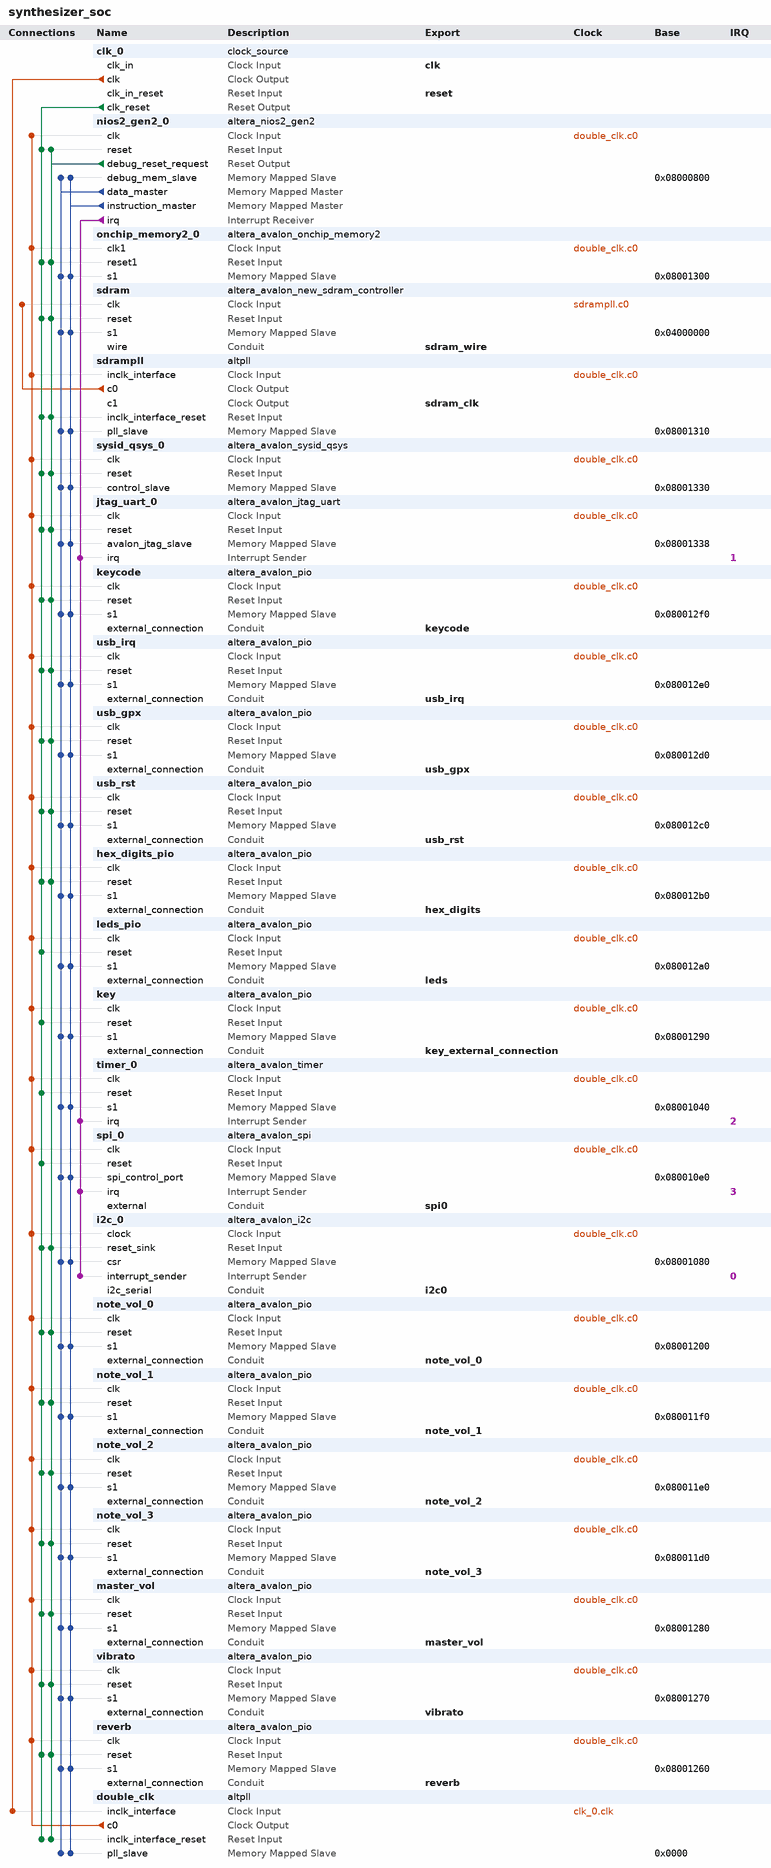
[diagram p0: system contents]
# Platform Designer (Qsys) system synthesizer_soc, MAX 10 10M50DAF484C7G
# Parameters at their usual value, and those the tool derives, are not listed.
package require -exact qsys 18.1
create_system synthesizer_soc
set_project_property DEVICE_FAMILY {MAX 10}
set_project_property DEVICE 10M50DAF484C7G

add_instance clk_0 clock_source 18.1
set_instance_parameter_value clk_0 clockFrequency 50000000

add_instance nios2_gen2_0 altera_nios2_gen2 18.1
set_instance_parameter_value nios2_gen2_0 dcache_size 2048
set_instance_parameter_value nios2_gen2_0 exceptionSlave sdram.s1
set_instance_parameter_value nios2_gen2_0 icache_size 4096
set_instance_parameter_value nios2_gen2_0 impl Tiny
set_instance_parameter_value nios2_gen2_0 resetSlave sdram.s1

add_instance onchip_memory2_0 altera_avalon_onchip_memory2 18.1
set_instance_parameter_value onchip_memory2_0 dataWidth 32
set_instance_parameter_value onchip_memory2_0 dualPort false
set_instance_parameter_value onchip_memory2_0 initMemContent true
set_instance_parameter_value onchip_memory2_0 initializationFileName onchip_mem.hex
set_instance_parameter_value onchip_memory2_0 memorySize 16

add_instance sdram altera_avalon_new_sdram_controller 18.1
set_instance_parameter_value sdram TAC 5.4
set_instance_parameter_value sdram TRCD 20.0
set_instance_parameter_value sdram TRP 20.0
set_instance_parameter_value sdram casLatency 3
set_instance_parameter_value sdram columnWidth 10
set_instance_parameter_value sdram dataWidth 16
set_instance_parameter_value sdram generateSimulationModel false
set_instance_parameter_value sdram model single_Micron_MT48LC4M32B2_7_chip
set_instance_parameter_value sdram numberOfBanks 4
set_instance_parameter_value sdram numberOfChipSelects 1
set_instance_parameter_value sdram powerUpDelay 200.0
set_instance_parameter_value sdram refreshPeriod 15.625
set_instance_parameter_value sdram rowWidth 13

add_instance sdrampll altpll 18.1
set_instance_parameter_value sdrampll CLK0_DIVIDE_BY 1
set_instance_parameter_value sdrampll CLK0_MULTIPLY_BY 1
set_instance_parameter_value sdrampll CLK1_DIVIDE_BY 1
set_instance_parameter_value sdrampll CLK1_DUTY_CYCLE 50
set_instance_parameter_value sdrampll CLK1_MULTIPLY_BY 1
set_instance_parameter_value sdrampll CLK1_PHASE_SHIFT -1000
set_instance_parameter_value sdrampll INCLK0_INPUT_FREQUENCY 20000
set_instance_parameter_value sdrampll PORT_ARESET PORT_UNUSED
set_instance_parameter_value sdrampll PORT_LOCKED PORT_UNUSED
set_instance_parameter_value sdrampll PORT_clk1 PORT_USED
set_instance_parameter_value sdrampll PORT_clk2 PORT_UNUSED
set_instance_parameter_value sdrampll PORT_clk3 PORT_UNUSED

add_instance sysid_qsys_0 altera_avalon_sysid_qsys 18.1
set_instance_parameter_value sysid_qsys_0 id 0

add_instance jtag_uart_0 altera_avalon_jtag_uart 18.1
set_instance_parameter_value jtag_uart_0 simInteractiveOptions NO_INTERACTIVE_WINDOWS

add_instance keycode altera_avalon_pio 18.1
set_instance_parameter_value keycode direction Output
set_instance_parameter_value keycode width 8

add_instance usb_irq altera_avalon_pio 18.1
set_instance_parameter_value usb_irq direction Input
set_instance_parameter_value usb_irq width 1

add_instance usb_gpx altera_avalon_pio 18.1
set_instance_parameter_value usb_gpx direction Input
set_instance_parameter_value usb_gpx width 1

add_instance usb_rst altera_avalon_pio 18.1
set_instance_parameter_value usb_rst direction Output
set_instance_parameter_value usb_rst width 1

add_instance hex_digits_pio altera_avalon_pio 18.1
set_instance_parameter_value hex_digits_pio direction Output
set_instance_parameter_value hex_digits_pio width 16

add_instance leds_pio altera_avalon_pio 18.1
set_instance_parameter_value leds_pio direction Output
set_instance_parameter_value leds_pio width 14

add_instance key altera_avalon_pio 18.1
set_instance_parameter_value key direction Input
set_instance_parameter_value key width 2

add_instance timer_0 altera_avalon_timer 18.1
set_instance_parameter_value timer_0 counterSize 64
set_instance_parameter_value timer_0 period 1
set_instance_parameter_value timer_0 periodUnits MSEC

add_instance spi_0 altera_avalon_spi 18.1
set_instance_parameter_value spi_0 clockPolarity 0
set_instance_parameter_value spi_0 dataWidth 8
set_instance_parameter_value spi_0 masterSPI true
set_instance_parameter_value spi_0 numberOfSlaves 1
set_instance_parameter_value spi_0 targetClockRate 4000000

add_instance i2c_0 altera_avalon_i2c 18.1
set_instance_parameter_value i2c_0 FIFO_DEPTH 4

add_instance note_vol_0 altera_avalon_pio 18.1
set_instance_parameter_value note_vol_0 direction Output
set_instance_parameter_value note_vol_0 width 16

add_instance note_vol_1 altera_avalon_pio 18.1
set_instance_parameter_value note_vol_1 direction Output
set_instance_parameter_value note_vol_1 width 16

add_instance note_vol_2 altera_avalon_pio 18.1
set_instance_parameter_value note_vol_2 direction Output
set_instance_parameter_value note_vol_2 width 16

add_instance note_vol_3 altera_avalon_pio 18.1
set_instance_parameter_value note_vol_3 direction Output
set_instance_parameter_value note_vol_3 width 16

add_instance master_vol altera_avalon_pio 18.1
set_instance_parameter_value master_vol direction Output
set_instance_parameter_value master_vol width 8

add_instance vibrato altera_avalon_pio 18.1
set_instance_parameter_value vibrato direction Output
set_instance_parameter_value vibrato width 8

add_instance reverb altera_avalon_pio 18.1
set_instance_parameter_value reverb direction Output
set_instance_parameter_value reverb width 8

add_instance double_clk altpll 18.1
set_instance_parameter_value double_clk CLK0_DIVIDE_BY 5
set_instance_parameter_value double_clk CLK0_MULTIPLY_BY 8
set_instance_parameter_value double_clk INCLK0_INPUT_FREQUENCY 20000
set_instance_parameter_value double_clk PORT_ARESET PORT_UNUSED
set_instance_parameter_value double_clk PORT_LOCKED PORT_UNUSED
set_instance_parameter_value double_clk PORT_clk1 PORT_UNUSED
set_instance_parameter_value double_clk PORT_clk2 PORT_UNUSED
set_instance_parameter_value double_clk PORT_clk3 PORT_UNUSED

# connections
add_connection clk_0.clk double_clk.inclk_interface clock
add_connection double_clk.c0 hex_digits_pio.clk clock
add_connection double_clk.c0 i2c_0.clock clock
add_connection double_clk.c0 jtag_uart_0.clk clock
add_connection double_clk.c0 key.clk clock
add_connection double_clk.c0 keycode.clk clock
add_connection double_clk.c0 leds_pio.clk clock
add_connection double_clk.c0 master_vol.clk clock
add_connection double_clk.c0 nios2_gen2_0.clk clock
add_connection double_clk.c0 note_vol_0.clk clock
add_connection double_clk.c0 note_vol_1.clk clock
add_connection double_clk.c0 note_vol_2.clk clock
add_connection double_clk.c0 note_vol_3.clk clock
add_connection double_clk.c0 onchip_memory2_0.clk1 clock
add_connection double_clk.c0 reverb.clk clock
add_connection double_clk.c0 sdrampll.inclk_interface clock
add_connection double_clk.c0 spi_0.clk clock
add_connection double_clk.c0 sysid_qsys_0.clk clock
add_connection double_clk.c0 timer_0.clk clock
add_connection double_clk.c0 usb_gpx.clk clock
add_connection double_clk.c0 usb_irq.clk clock
add_connection double_clk.c0 usb_rst.clk clock
add_connection double_clk.c0 vibrato.clk clock
add_connection sdrampll.c0 sdram.clk clock
add_connection clk_0.clk_reset double_clk.inclk_interface_reset reset
add_connection clk_0.clk_reset hex_digits_pio.reset reset
add_connection clk_0.clk_reset i2c_0.reset_sink reset
add_connection clk_0.clk_reset jtag_uart_0.reset reset
add_connection clk_0.clk_reset key.reset reset
add_connection clk_0.clk_reset keycode.reset reset
add_connection clk_0.clk_reset leds_pio.reset reset
add_connection clk_0.clk_reset master_vol.reset reset
add_connection clk_0.clk_reset nios2_gen2_0.reset reset
add_connection clk_0.clk_reset note_vol_0.reset reset
add_connection clk_0.clk_reset note_vol_1.reset reset
add_connection clk_0.clk_reset note_vol_2.reset reset
add_connection clk_0.clk_reset note_vol_3.reset reset
add_connection clk_0.clk_reset onchip_memory2_0.reset1 reset
add_connection clk_0.clk_reset reverb.reset reset
add_connection clk_0.clk_reset sdram.reset reset
add_connection clk_0.clk_reset sdrampll.inclk_interface_reset reset
add_connection clk_0.clk_reset spi_0.reset reset
add_connection clk_0.clk_reset sysid_qsys_0.reset reset
add_connection clk_0.clk_reset timer_0.reset reset
add_connection clk_0.clk_reset usb_gpx.reset reset
add_connection clk_0.clk_reset usb_irq.reset reset
add_connection clk_0.clk_reset usb_rst.reset reset
add_connection clk_0.clk_reset vibrato.reset reset
add_connection nios2_gen2_0.debug_reset_request double_clk.inclk_interface_reset reset
add_connection nios2_gen2_0.debug_reset_request hex_digits_pio.reset reset
add_connection nios2_gen2_0.debug_reset_request i2c_0.reset_sink reset
add_connection nios2_gen2_0.debug_reset_request jtag_uart_0.reset reset
add_connection nios2_gen2_0.debug_reset_request keycode.reset reset
add_connection nios2_gen2_0.debug_reset_request master_vol.reset reset
add_connection nios2_gen2_0.debug_reset_request nios2_gen2_0.reset reset
add_connection nios2_gen2_0.debug_reset_request note_vol_0.reset reset
add_connection nios2_gen2_0.debug_reset_request note_vol_1.reset reset
add_connection nios2_gen2_0.debug_reset_request note_vol_2.reset reset
add_connection nios2_gen2_0.debug_reset_request note_vol_3.reset reset
add_connection nios2_gen2_0.debug_reset_request onchip_memory2_0.reset1 reset
add_connection nios2_gen2_0.debug_reset_request reverb.reset reset
add_connection nios2_gen2_0.debug_reset_request sdram.reset reset
add_connection nios2_gen2_0.debug_reset_request sdrampll.inclk_interface_reset reset
add_connection nios2_gen2_0.debug_reset_request sysid_qsys_0.reset reset
add_connection nios2_gen2_0.debug_reset_request usb_gpx.reset reset
add_connection nios2_gen2_0.debug_reset_request usb_irq.reset reset
add_connection nios2_gen2_0.debug_reset_request usb_rst.reset reset
add_connection nios2_gen2_0.debug_reset_request vibrato.reset reset
add_connection nios2_gen2_0.data_master double_clk.pll_slave avalon
set_connection_parameter_value nios2_gen2_0.data_master/double_clk.pll_slave baseAddress 0x0000
add_connection nios2_gen2_0.data_master hex_digits_pio.s1 avalon
set_connection_parameter_value nios2_gen2_0.data_master/hex_digits_pio.s1 baseAddress 0x080012b0
add_connection nios2_gen2_0.data_master i2c_0.csr avalon
set_connection_parameter_value nios2_gen2_0.data_master/i2c_0.csr baseAddress 0x08001080
add_connection nios2_gen2_0.data_master jtag_uart_0.avalon_jtag_slave avalon
set_connection_parameter_value nios2_gen2_0.data_master/jtag_uart_0.avalon_jtag_slave baseAddress 0x08001338
add_connection nios2_gen2_0.data_master key.s1 avalon
set_connection_parameter_value nios2_gen2_0.data_master/key.s1 baseAddress 0x08001290
add_connection nios2_gen2_0.data_master keycode.s1 avalon
set_connection_parameter_value nios2_gen2_0.data_master/keycode.s1 baseAddress 0x080012f0
add_connection nios2_gen2_0.data_master leds_pio.s1 avalon
set_connection_parameter_value nios2_gen2_0.data_master/leds_pio.s1 baseAddress 0x080012a0
add_connection nios2_gen2_0.data_master master_vol.s1 avalon
set_connection_parameter_value nios2_gen2_0.data_master/master_vol.s1 baseAddress 0x08001280
add_connection nios2_gen2_0.data_master nios2_gen2_0.debug_mem_slave avalon
set_connection_parameter_value nios2_gen2_0.data_master/nios2_gen2_0.debug_mem_slave baseAddress 0x08000800
add_connection nios2_gen2_0.data_master note_vol_0.s1 avalon
set_connection_parameter_value nios2_gen2_0.data_master/note_vol_0.s1 baseAddress 0x08001200
add_connection nios2_gen2_0.data_master note_vol_1.s1 avalon
set_connection_parameter_value nios2_gen2_0.data_master/note_vol_1.s1 baseAddress 0x080011f0
add_connection nios2_gen2_0.data_master note_vol_2.s1 avalon
set_connection_parameter_value nios2_gen2_0.data_master/note_vol_2.s1 baseAddress 0x080011e0
add_connection nios2_gen2_0.data_master note_vol_3.s1 avalon
set_connection_parameter_value nios2_gen2_0.data_master/note_vol_3.s1 baseAddress 0x080011d0
add_connection nios2_gen2_0.data_master onchip_memory2_0.s1 avalon
set_connection_parameter_value nios2_gen2_0.data_master/onchip_memory2_0.s1 baseAddress 0x08001300
add_connection nios2_gen2_0.data_master reverb.s1 avalon
set_connection_parameter_value nios2_gen2_0.data_master/reverb.s1 baseAddress 0x08001260
add_connection nios2_gen2_0.data_master sdram.s1 avalon
set_connection_parameter_value nios2_gen2_0.data_master/sdram.s1 baseAddress 0x04000000
add_connection nios2_gen2_0.data_master sdrampll.pll_slave avalon
set_connection_parameter_value nios2_gen2_0.data_master/sdrampll.pll_slave baseAddress 0x08001310
add_connection nios2_gen2_0.data_master spi_0.spi_control_port avalon
set_connection_parameter_value nios2_gen2_0.data_master/spi_0.spi_control_port baseAddress 0x080010e0
add_connection nios2_gen2_0.data_master sysid_qsys_0.control_slave avalon
set_connection_parameter_value nios2_gen2_0.data_master/sysid_qsys_0.control_slave baseAddress 0x08001330
add_connection nios2_gen2_0.data_master timer_0.s1 avalon
set_connection_parameter_value nios2_gen2_0.data_master/timer_0.s1 baseAddress 0x08001040
add_connection nios2_gen2_0.data_master usb_gpx.s1 avalon
set_connection_parameter_value nios2_gen2_0.data_master/usb_gpx.s1 baseAddress 0x080012d0
add_connection nios2_gen2_0.data_master usb_irq.s1 avalon
set_connection_parameter_value nios2_gen2_0.data_master/usb_irq.s1 baseAddress 0x080012e0
add_connection nios2_gen2_0.data_master usb_rst.s1 avalon
set_connection_parameter_value nios2_gen2_0.data_master/usb_rst.s1 baseAddress 0x080012c0
add_connection nios2_gen2_0.data_master vibrato.s1 avalon
set_connection_parameter_value nios2_gen2_0.data_master/vibrato.s1 baseAddress 0x08001270
add_connection nios2_gen2_0.instruction_master double_clk.pll_slave avalon
set_connection_parameter_value nios2_gen2_0.instruction_master/double_clk.pll_slave baseAddress 0x0000
add_connection nios2_gen2_0.instruction_master hex_digits_pio.s1 avalon
set_connection_parameter_value nios2_gen2_0.instruction_master/hex_digits_pio.s1 baseAddress 0x080012b0
add_connection nios2_gen2_0.instruction_master i2c_0.csr avalon
set_connection_parameter_value nios2_gen2_0.instruction_master/i2c_0.csr baseAddress 0x08001080
add_connection nios2_gen2_0.instruction_master jtag_uart_0.avalon_jtag_slave avalon
set_connection_parameter_value nios2_gen2_0.instruction_master/jtag_uart_0.avalon_jtag_slave baseAddress 0x08001338
add_connection nios2_gen2_0.instruction_master key.s1 avalon
set_connection_parameter_value nios2_gen2_0.instruction_master/key.s1 baseAddress 0x08001290
add_connection nios2_gen2_0.instruction_master keycode.s1 avalon
set_connection_parameter_value nios2_gen2_0.instruction_master/keycode.s1 baseAddress 0x080012f0
add_connection nios2_gen2_0.instruction_master leds_pio.s1 avalon
set_connection_parameter_value nios2_gen2_0.instruction_master/leds_pio.s1 baseAddress 0x080012a0
add_connection nios2_gen2_0.instruction_master master_vol.s1 avalon
set_connection_parameter_value nios2_gen2_0.instruction_master/master_vol.s1 baseAddress 0x08001280
add_connection nios2_gen2_0.instruction_master nios2_gen2_0.debug_mem_slave avalon
set_connection_parameter_value nios2_gen2_0.instruction_master/nios2_gen2_0.debug_mem_slave baseAddress 0x08000800
add_connection nios2_gen2_0.instruction_master note_vol_0.s1 avalon
set_connection_parameter_value nios2_gen2_0.instruction_master/note_vol_0.s1 baseAddress 0x08001200
add_connection nios2_gen2_0.instruction_master note_vol_1.s1 avalon
set_connection_parameter_value nios2_gen2_0.instruction_master/note_vol_1.s1 baseAddress 0x080011f0
add_connection nios2_gen2_0.instruction_master note_vol_2.s1 avalon
set_connection_parameter_value nios2_gen2_0.instruction_master/note_vol_2.s1 baseAddress 0x080011e0
add_connection nios2_gen2_0.instruction_master note_vol_3.s1 avalon
set_connection_parameter_value nios2_gen2_0.instruction_master/note_vol_3.s1 baseAddress 0x080011d0
add_connection nios2_gen2_0.instruction_master onchip_memory2_0.s1 avalon
set_connection_parameter_value nios2_gen2_0.instruction_master/onchip_memory2_0.s1 baseAddress 0x08001300
add_connection nios2_gen2_0.instruction_master reverb.s1 avalon
set_connection_parameter_value nios2_gen2_0.instruction_master/reverb.s1 baseAddress 0x08001260
add_connection nios2_gen2_0.instruction_master sdram.s1 avalon
set_connection_parameter_value nios2_gen2_0.instruction_master/sdram.s1 baseAddress 0x04000000
add_connection nios2_gen2_0.instruction_master sdrampll.pll_slave avalon
set_connection_parameter_value nios2_gen2_0.instruction_master/sdrampll.pll_slave baseAddress 0x08001310
add_connection nios2_gen2_0.instruction_master spi_0.spi_control_port avalon
set_connection_parameter_value nios2_gen2_0.instruction_master/spi_0.spi_control_port baseAddress 0x080010e0
add_connection nios2_gen2_0.instruction_master sysid_qsys_0.control_slave avalon
set_connection_parameter_value nios2_gen2_0.instruction_master/sysid_qsys_0.control_slave baseAddress 0x08001330
add_connection nios2_gen2_0.instruction_master timer_0.s1 avalon
set_connection_parameter_value nios2_gen2_0.instruction_master/timer_0.s1 baseAddress 0x08001040
add_connection nios2_gen2_0.instruction_master usb_gpx.s1 avalon
set_connection_parameter_value nios2_gen2_0.instruction_master/usb_gpx.s1 baseAddress 0x080012d0
add_connection nios2_gen2_0.instruction_master usb_irq.s1 avalon
set_connection_parameter_value nios2_gen2_0.instruction_master/usb_irq.s1 baseAddress 0x080012e0
add_connection nios2_gen2_0.instruction_master usb_rst.s1 avalon
set_connection_parameter_value nios2_gen2_0.instruction_master/usb_rst.s1 baseAddress 0x080012c0
add_connection nios2_gen2_0.instruction_master vibrato.s1 avalon
set_connection_parameter_value nios2_gen2_0.instruction_master/vibrato.s1 baseAddress 0x08001270
add_connection nios2_gen2_0.irq i2c_0.interrupt_sender interrupt
set_connection_parameter_value nios2_gen2_0.irq/i2c_0.interrupt_sender irqNumber 0
add_connection nios2_gen2_0.irq jtag_uart_0.irq interrupt
set_connection_parameter_value nios2_gen2_0.irq/jtag_uart_0.irq irqNumber 1
add_connection nios2_gen2_0.irq spi_0.irq interrupt
set_connection_parameter_value nios2_gen2_0.irq/spi_0.irq irqNumber 3
add_connection nios2_gen2_0.irq timer_0.irq interrupt
set_connection_parameter_value nios2_gen2_0.irq/timer_0.irq irqNumber 2

# exported interfaces
add_interface clk clock sink
set_interface_property clk EXPORT_OF clk_0.clk_in
add_interface hex_digits conduit end
set_interface_property hex_digits EXPORT_OF hex_digits_pio.external_connection
add_interface i2c0 conduit end
set_interface_property i2c0 EXPORT_OF i2c_0.i2c_serial
add_interface key_external_connection conduit end
set_interface_property key_external_connection EXPORT_OF key.external_connection
add_interface keycode conduit end
set_interface_property keycode EXPORT_OF keycode.external_connection
add_interface leds conduit end
set_interface_property leds EXPORT_OF leds_pio.external_connection
add_interface master_vol conduit end
set_interface_property master_vol EXPORT_OF master_vol.external_connection
add_interface note_vol_0 conduit end
set_interface_property note_vol_0 EXPORT_OF note_vol_0.external_connection
add_interface note_vol_1 conduit end
set_interface_property note_vol_1 EXPORT_OF note_vol_1.external_connection
add_interface note_vol_2 conduit end
set_interface_property note_vol_2 EXPORT_OF note_vol_2.external_connection
add_interface note_vol_3 conduit end
set_interface_property note_vol_3 EXPORT_OF note_vol_3.external_connection
add_interface reset reset sink
set_interface_property reset EXPORT_OF clk_0.clk_in_reset
add_interface reverb conduit end
set_interface_property reverb EXPORT_OF reverb.external_connection
add_interface sdram_clk clock source
set_interface_property sdram_clk EXPORT_OF sdrampll.c1
add_interface sdram_wire conduit end
set_interface_property sdram_wire EXPORT_OF sdram.wire
add_interface spi0 conduit end
set_interface_property spi0 EXPORT_OF spi_0.external
add_interface usb_gpx conduit end
set_interface_property usb_gpx EXPORT_OF usb_gpx.external_connection
add_interface usb_irq conduit end
set_interface_property usb_irq EXPORT_OF usb_irq.external_connection
add_interface usb_rst conduit end
set_interface_property usb_rst EXPORT_OF usb_rst.external_connection
add_interface vibrato conduit end
set_interface_property vibrato EXPORT_OF vibrato.external_connection

set_interconnect_requirement {$system} qsys_mm.clockCrossingAdapter HANDSHAKE
set_interconnect_requirement {$system} qsys_mm.enableEccProtection FALSE
set_interconnect_requirement {$system} qsys_mm.insertDefaultSlave FALSE
set_interconnect_requirement {$system} qsys_mm.maxAdditionalLatency 1

save_system synthesizer_soc.qsys
